# EAGLE design matchbox_dpy_sm_v11 (EAGLE 7.4.0)
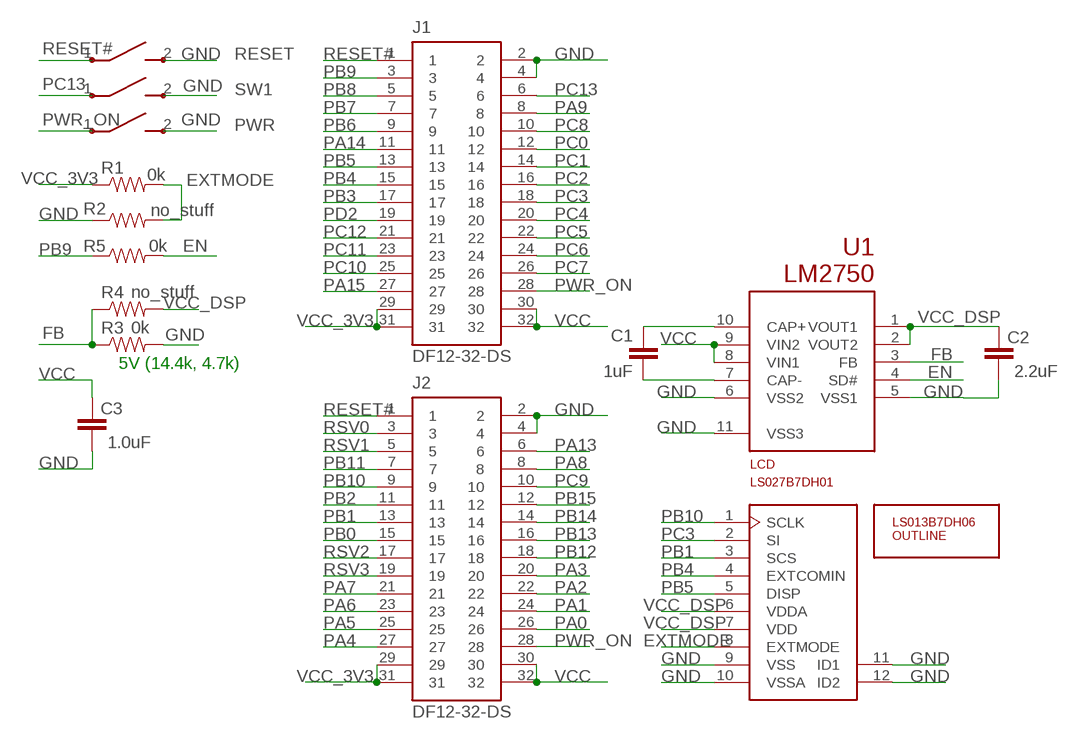
[diagram p0: schematic, sheet 1]

## Parts
C1  1uF  CAP0805  [0805]
C2  2.2uF  CAP0805  [0805]
C3  1.0uF  CAP0805  [0805]
J1  DF12-32-DS  AS-ITM-00012  [DF12-32-DS]
J2  DF12-32-DS  AS-ITM-00012  [DF12-32-DS]
LCD  LS027B7DH01  [MOLEX-51441-1093]
PWR  B3U-3100PM-B  [B3U-3100PM-B]
R1  0k  RESISTOR0805-RES  [0805]
R2  no_stuff  RESISTOR0805-RES  [0805]
R3  0k  RESISTOR0805-RES  [0805]
R4  no_stuff  RESISTOR0805-RES  [0805]
R5  0k  RESISTOR0805-RES  [0805]
RESET  B3U-3100PM-B  [B3U-3100PM-B]
SW1  B3U-3100PM-B  [B3U-3100PM-B]
U1  LM2750  [LM2750]
U$1  LS013B7DH06-OUTLINE  [LS013B7DH06]

## Nets
EN: R5.2 U1.4(SD#)
EXTMODE: LCD.8(EXTMODE) R1.2 R2.2
FB: R3.1 R4.1 U1.3(FB)
GND: C2.2 C3.2 J1.2 J1.4 J2.2 J2.4 LCD.9(VSS) LCD.10(VSSA) LCD.11(ID1) LCD.12(ID2) PWR.2 R2.1 R3.2 RESET.2 SW1.2 U1.5(VSS1) U1.6(VSS2) U1.11(VSS3)
N$1: C1.1 U1.10(CAP+)
N$2: C1.2 U1.7(CAP-)
PA0: J2.26
PA1: J2.24
PA2: J2.22
PA3: J2.20
PA4: J2.27
PA5: J2.25
PA6: J2.23
PA7: J2.21
PA8: J2.8
PA9: J1.8
PA13: J2.6
PA14: J1.11
PA15: J1.27
PB0: J2.15
PB1: J2.13 LCD.3(SCS)
PB2: J2.11
PB3: J1.17
PB4: J1.15 LCD.4(EXTCOMIN)
PB5: J1.13 LCD.5(DISP)
PB6: J1.9
PB7: J1.7
PB8: J1.5
PB9: J1.3 R5.1
PB10: J2.9 LCD.1(SCLK)
PB11: J2.7
PB12: J2.18
PB13: J2.16
PB14: J2.14
PB15: J2.12
PC0: J1.12
PC1: J1.14
PC2: J1.16
PC3: J1.18 LCD.2(SI)
PC4: J1.20
PC5: J1.22
PC6: J1.24
PC7: J1.26
PC8: J1.10
PC9: J2.10
PC10: J1.25
PC11: J1.23
PC12: J1.21
PC13: J1.6 SW1.1
PD2: J1.19
PWR_ON: J1.28 J2.28 PWR.1
RESET#: J1.1 J2.1 RESET.1
RSV0: J2.3
RSV1: J2.5
RSV2: J2.17
RSV3: J2.19
VCC: C3.1 J1.30 J1.32 J2.30 J2.32 U1.8(VIN1) U1.9(VIN2)
VCC_3V3: J1.29 J1.31 J2.29 J2.31 R1.1
VCC_DSP: C2.1 LCD.6(VDDA) LCD.7(VDD) R4.2 U1.1(VOUT1) U1.2(VOUT2)

## Notes on the sheet
- 5V (14.4k, 4.7k)

## Power pins joined to a net without a drawn wire
GND: PWR.GND RESET.GND SW1.GND

## Library data of the parts
C1-C3 = SparkFun-Passives:CAP: Capacitor Standard 0603 ceramic capacitor, and 0.1" leaded capacitor.; MF: CORNELL DUBILIER; MPN: 106K050CS4; OC_NEWARK: 01F367
J1 J2 = micro1292:AS-ITM-00012: CONN RECEPT 32POS 3MM SMD 0.5MM; PARTNO: AS-ITM-00012
LCD = sharp_display:LS027B7DH01
PWR RESET SW1 = sharp_display:B3U-3100PM-B
R1-R5 = SparkFun-Passives:RESISTOR: Resistor Basic schematic elements and footprints for 0603, 1206, and PTH resistors.
U1 = sharp_display:LM2750
U$1 = sharp_display:LS013B7DH06-OUTLINE

## Board
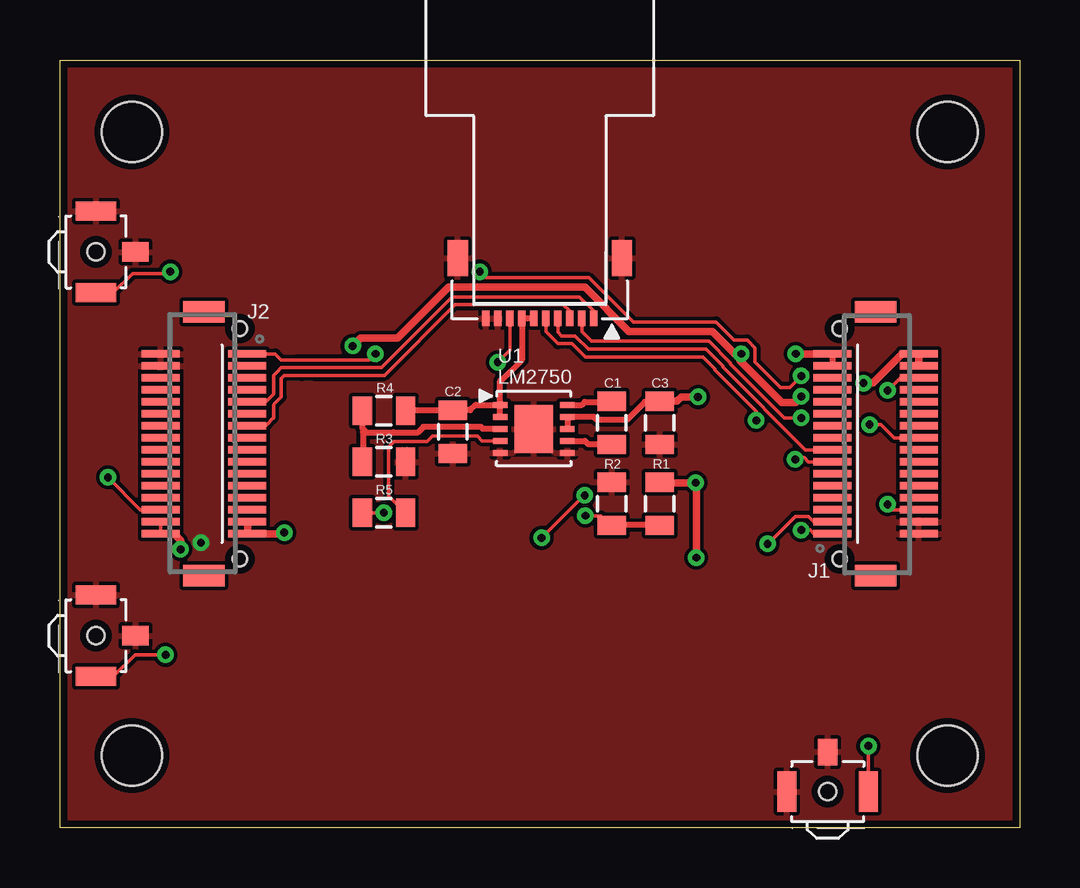
[diagram p1: board, top side]
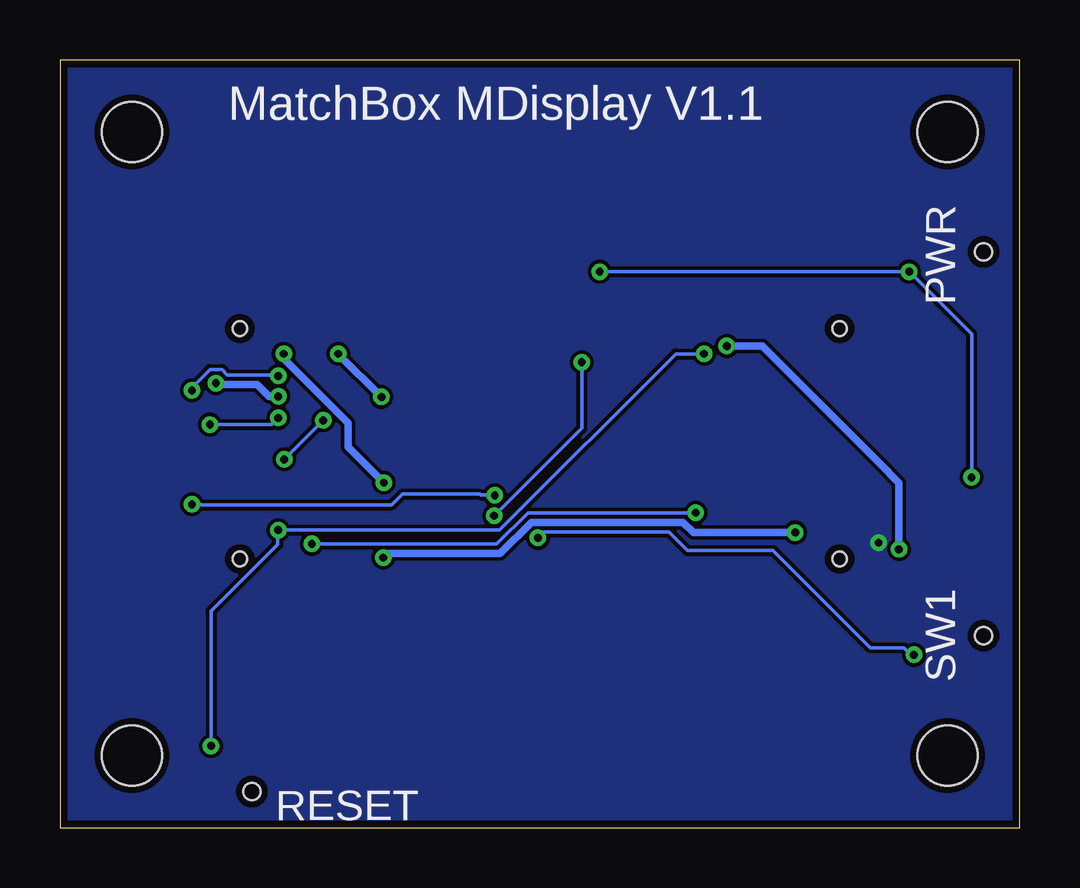
[diagram p2: board, bottom side, seen from below]

Size 40 x 32 mm. Coordinates in mm from the lower left corner, seen from the top.
Outline: 40,0 0,0 0,32 40,32 40,0
Copper layers (1*16): Top 0.0356mm / dielectric 1.5011mm / Bottom 0.0356mm
Design rules "LaenPCBOrder (2) *": minimum track width 6mil, minimum drill 13mil, track to track 6mil, track to pad 6mil, pad to pad 6mil, via to via 6mil, smd to smd 6mil, copper to edge 12mil, drill to drill 6mil, minimum pad ring 7mil, minimum via ring 7mil, stop-mask expansion 14mil, vias tented up to drill 14mil, thermal gap 6mil
Holes 2.5 mm at 3,29 37,29 37,3 3,3

### Footprints (pad centres in the part's own frame; a part is rotated, then mirrored left to right if it is on the bottom)
0805 = smd 0.8 x 1.2: 1 -0.9,0; 2 0.9,0
DF12-32-DS = smd 0.3 x 1.6: 1 -3.75,1.8; 2 -3.75,-1.8; 3 -3.25,1.8; 4 -3.25,-1.8; 5 -2.75,1.8; 6 -2.75,-1.8; 7 -2.25,1.8; 8 -2.25,-1.8; 9 -1.75,1.8; 10 -1.75,-1.8; 11 -1.25,1.8; 12 -1.25,-1.8; 13 -0.75,1.8; 14 -0.75,-1.8; 15 -0.25,1.8; 16 -0.25,-1.8; 17 0.25,1.8; 18 0.25,-1.8; 19 0.75,1.8; 20 0.75,-1.8; 21 1.25,1.8; 22 1.25,-1.8; 23 1.75,1.8; 24 1.75,-1.8; 25 2.25,1.8; 26 2.25,-1.8; 27 2.75,1.8; 28 2.75,-1.8; 29 3.25,1.8; 30 3.25,-1.8; 31 3.75,1.8; 32 3.75,-1.8 | smd 0.889 x 1.727: F1 -5.5,0; F2 5.5,0 | hole 0.6: -4.8,1.5; 4.8,1.5
MOLEX-51441-1093 = smd 0.3 x 0.65: 1 -2.25,3.275; 2 -1.75,3.275; 3 -1.25,3.275; 4 -0.75,3.275; 5 -0.25,3.275; 6 0.25,3.275; 7 0.75,3.275; 8 1.25,3.275; 9 1.75,3.275; 10 2.25,3.275 | smd 0.85 x 1.5: 11 -3.425,0.75; 12 3.425,0.75
B3U-3100PM-B = smd 0.8 x 1.7: 1 -1.7,0; 2 1.7,0 | smd 0.8 x 1.1: GND 0,-1.65 | hole 0.7: 0,0
LM2750 = smd 0.25 x 0.6: 1 -1,-1.4; 2 -0.5,-1.4; 3 0,-1.4; 4 0.5,-1.4; 5 1,-1.4; 6 1,1.4; 7 0.5,1.4; 8 0,1.4; 9 -0.5,1.4; 10 -1,1.4 | smd 2 x 1.6: 11 0,0

### Placement (x,y rotation side)
C1  23,16.88 270 top
C2  16.38,16.5 270 top
C3  25,16.88 270 top
J1  34,16 90 top
J2  6,16 270 top
LCD  20,24.5 180 top
PWR  1.5,24 90 top
R1  25,13.5 270 top
R2  23,13.5 270 top
R3  13.5,15.25 0 top
R4  13.5,17.38 0 top
R5  13.5,13.12 0 top
RESET  32,1.5 180 top
SW1  1.5,8 90 top
U1  19.75,16.62 270 top
U$1  20,35.5 0 top  (outside the outline)

### Tracks (layer width: path | path; a pad name or v marks a point on that pad's centre or on a via)
EN
  Top 0.152: U1.4 17.6,16.12 17.4,16.32 15.53,16.32 15.3,16.1 14.93,16.1 14.88,16.1 14.4,16.1 14.32,16.1 13.93,16.1 13.7,15.88 13.7,15.6 13.7,15.53 13.7,14.62 13.7,14.55 13.7,13.82 R5.2
EXTMODE  (via drill 0.33)
  Top 0.152: LCD.8 18.75,19.9 v18.25,19.4 | v21.9,13 22.55,13 22.95,12.6 R2.2
  Top 0.254: R2.2 23,12.62 25,12.62 R1.2
  Bottom 0.152: v18.25,19.4 18.25,16.65 v21.9,13
FB
  Top 0.254: U1.3 17.62,16.62 17.55,16.7 15.15,16.7 14.93,16.48 13.93,16.48 13.9,16.48 12.78,16.48 | 12.78,16.48 12.6,16.65 R4.1 | R3.1 12.62,15.25 12.62,16.48 12.78,16.48
GND  (via drill 0.33)
  other vias: 5.88,11.88
  pour Bottom: 40,0 0,0 0,32 40,32
  pour Top: 40,0 0,0 0,32 40,32
N$1
  Top 0.254: C1.1 23,17.75 21.88,17.75 21.75,17.62 21.25,17.62 U1.10
N$2
  Top 0.254: C1.2 23,16 22,16 21.88,16.12 21.25,16.12 U1.7
PB1
  Top 0.152: LCD.3 21.25,21.52 20.98,21.8 16.48,21.8 13.53,18.85 10.68,18.85 10.6,18.85 10.12,18.85 10.05,18.85 9.35,18.85 9.22,18.73 9.22,17.95 8.95,17.68 8.9,17.62 8.9,17.07 8.85,17.02 8.68,16.85 8.65,16.82 8.57,16.75 7.9,16.75 J2.13 7.83,16.75
PB4
  Top 0.152: LCD.4 20.75,20.65 20.9,20.5 21.2,20.5 21.48,20.5 22.02,19.95 26.93,19.95 27.62,19.25 27.62,19.2 31.07,15.75 32.17,15.75 J1.15
PB5  (via drill 0.33)
  Top 0.152: LCD.5 20.25,20.68 20.75,20.18 21.35,20.18 21.9,19.62 26.8,19.62 27.3,19.12 27.3,19.07 29.02,17.35 v29.02,16.98 | v30.65,15.35 30.75,15.45 30.93,15.45 30.98,15.4 31,15.43 31.02,15.43 31.2,15.25 32.17,15.25 J1.13
  Bottom 0.152: v30.65,15.35 v29.02,16.98
PB9  (via drill 0.33)
  Top 0.152: v13.5,13.12 R5.1 | v29.5,11.82 30.65,12.97 31.2,12.97 31.43,12.75 32.17,12.75 J1.3
  Bottom 0.152: v13.5,13.12 20.5,13.12 21.8,11.82 v29.5,11.82
PB10
  Top 0.152: LCD.1 22.25,21.52 21.65,22.12 16.35,22.12 13.4,19.18 10,19.18 9.93,19.18 9.5,19.18 9.43,19.18 9.22,19.18 9.05,19 8.9,18.85 8.9,18.15 8.9,18.07 8.62,17.8 8.57,17.75 7.83,17.75 J2.9
PC3  (via drill 0.33)
  Top 0.152: LCD.2 21.75,20.68 22.15,20.27 27.05,20.27 27.95,19.38 27.95,19.32 30.2,17.07 v30.9,17.07 | v33.75,16.8 34.23,16.8 34.77,16.25 J1.18 | J1.18
  Bottom 0.152: v30.9,17.07 31.18,16.8 v33.75,16.8
PC13  (via drill 0.33)
  Top 0.152: v4.4,7.2 3.12,7.2 2.23,6.3 SW1.1 | v20.07,12.07 21.85,13.85 v21.88,13.85 | v34.5,13.47 34.73,13.25 J1.6 | J1.6
  Bottom 0.152: v4.4,7.2 4.53,7.2 4.83,7.5 6.22,7.5 10.28,11.55 13.85,11.55 14.62,12.32 19.82,12.32 v20.07,12.07 | v21.88,13.85 21.9,13.88 22.48,13.88 22.5,13.9 25.73,13.9 26.18,13.45 34.1,13.45 34.12,13.47 v34.5,13.47
PWR_ON  (via drill 0.33)
  Top 0.152: v17.5,23.18 17.75,22.93 22.05,22.93 23.9,21.07 27.35,21.07 28.07,20.35 28.1,20.32 28.2,20.32 28.65,20.32 28.7,20.27 28.98,20 28.98,19.4 30.02,18.35 30.07,18.35 30.43,18.35 v30.9,18.82 | 1.57,22.3 PWR.1 2.23,22.3 3.02,23.1 4.53,23.1 v4.6,23.18 | v34.5,18.23 35.02,18.75 J1.28 | J2.28 3.35,13.25 v2,14.6
  Bottom 0.152: v17.5,23.18 v4.6,23.18 2,20.57 v2,14.6 | v30.9,18.82 30.95,18.82 31,18.88 33.02,18.88 33.25,19.1 33.75,19.1 34.5,18.35 v34.5,18.23
RESET#  (via drill 0.33)
  Top 0.152: v30.9,12.4 31.27,12.4 31.43,12.25 32.17,12.25 J1.1 | 7.83,19.75 J2.1 | v33.7,3.4 RESET.1 | 13.12,19.75 v13.15,19.75 13.12,19.75 | 7.88,19.75 J2.1 | 13.12,19.75 12.88,19.5 9.88,19.5 9.22,19.5 8.97,19.75 7.88,19.75 | 7.88,19.75 J2.1
  Bottom 0.152: v13.15,19.75 14.32,19.75 21.68,12.4 v30.9,12.4 30.93,12.38 30.93,11.8 33.7,9.03 v33.7,3.4
VCC  (via drill 0.33)
  Top 0.152: J2.30 J2.32 | J2.32 | J2.30
  Top 0.254: U1.8 U1.9 21.25,17.12 22.25,17.12 22.38,17 23.62,17 24.38,17.75 25,17.75 C3.1
  Top 0.305: v26.6,17.95 25.9,17.95 25.73,17.77 25.12,17.77 C3.1 | 28.35,19.75 28.2,19.75 28.12,19.75 27.2,20.68 24.88,20.68 24.85,20.68 24.82,20.68 23.73,20.68 21.88,22.52 16.2,22.52 14.07,20.4 12.53,20.4 v12.2,20.07 | 28.35,19.75 v28.4,19.75 | v5.03,11.6 5.03,11.97 4.75,12.25 4.28,12.25 J2.32 | v33.5,18.52 33.65,18.52 33.88,18.52 35.1,19.75 35.73,19.75 J1.32 J1.30 | 28.5,19.75 v28.4,19.75 | 28.35,19.75 28.35,19.48 30.1,17.73 30.25,17.73 30.65,17.73 v30.9,17.98 | 28.35,19.75 v28.4,19.75
  Bottom 0.305: v28.4,19.75 v26.6,17.95 | v30.9,17.98 31.18,17.98 31.27,17.98 31.77,18.48 33.45,18.48 v33.5,18.52 | v12.2,20.07 10.72,20.07 5.83,15.18 5.03,14.38 v5.03,11.6
VCC_3V3  (via drill 0.33)
  Top 0.254: J1.31 J1.29
  Top 0.305: v30.68,19.75 32.08,19.75 J1.31 | 7.88,12.25 7.83,12.25 | 7.83,12.25 J2.31 8.03,12.25 9.3,12.25 v9.35,12.3 | J2.29 7.83,12.75 7.83,12.4 7.83,12.25 | R1.1 25.02,14.38 v26.5,14.38 | v26.5,14.38 26.52,14.38 | v26.52,11.25 26.52,14.35 v26.5,14.38
  Bottom 0.305: v30.68,19.75 30.62,19.75 30.62,19.5 28,16.88 28,15.88 v26.5,14.38 | v9.35,12.3 13.6,12.3 14.03,12.72 20.35,12.72 21.65,11.43 26.45,11.43 26.52,11.35 v26.52,11.25
VCC_DSP
  Top 0.254: U1.2 U1.1 | U1.1 18.23,17.62 17.32,17.62 17.1,17.4 C2.1 14.43,17.4 R4.2 | 18.35,18.6 18.35,18.62 18.35,18.6 | 18.35,18.6 19.25,19.5 LCD.7 LCD.6 | 18.35,18.6 18.35,17.75 U1.1

### Text on the board
bNames: MatchBox MDisplay V1.1